# Altium schematic sheet main.SchDoc
size A4; SheetNumber: 1; SheetTotal: 4
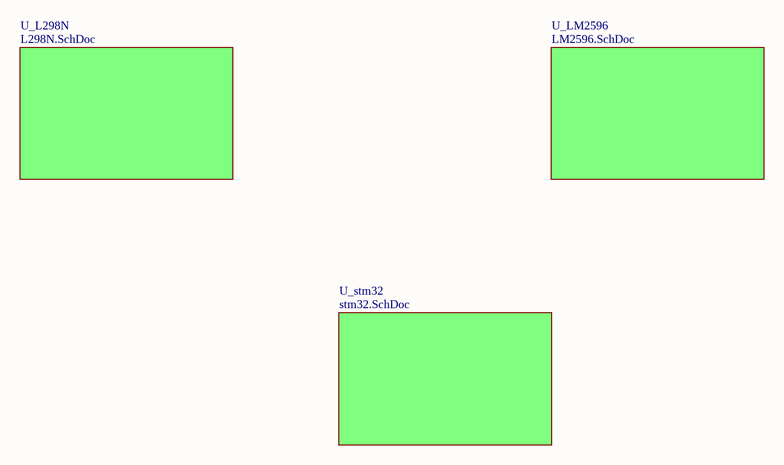
[diagram p0: main.SchDoc]

## Sub-sheets
U_L298N = L298N.SchDoc: no entries
U_LM2596 = LM2596.SchDoc: no entries
U_stm32 = stm32.SchDoc: no entries